# Altium schematic sheet IQ_modulator.SchDoc
size A4
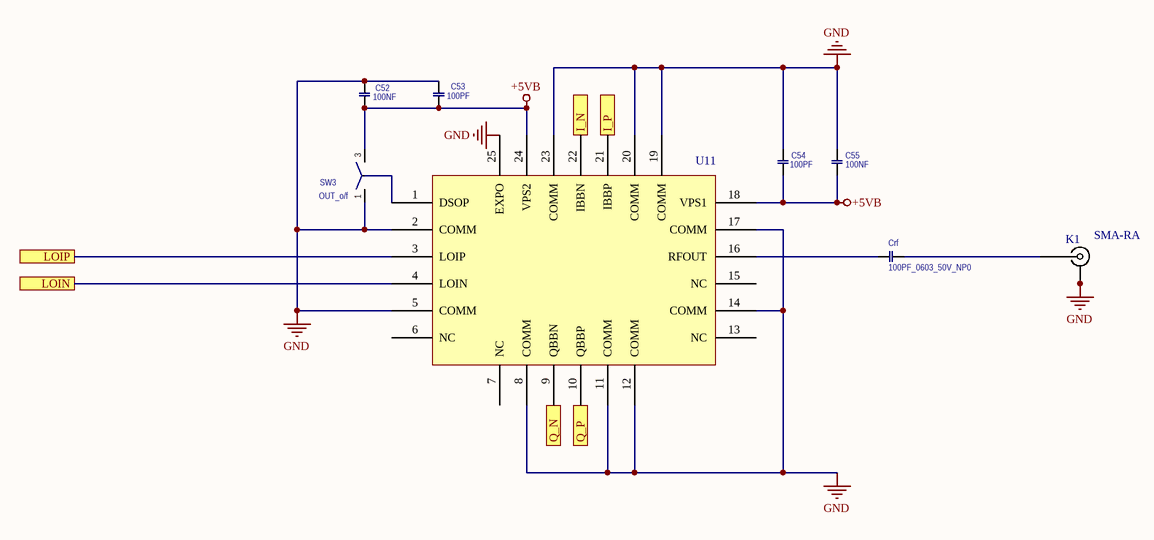
[diagram p0: IQ_modulator.SchDoc]

## Parts
C52  100NF  [CAP0603]
C53  100PF  [CAP0603]
C54  100PF  [CAP0603]
C55  100NF  [CAP0603]
Crf  100PF_0603_50V_NP0  [CAP0603]
K1  SMA-RA  [SMA-RA]
SW3  OUT_o/f  [X3APH-SLIDER]
U11  ADL5375  [LFCSP]  (value not drawn)

## Ports
I_N, I_P, LOIN, LOIP, Q_N, Q_P

## Nets
+5VB: C52.2 C53.2 C54.2 C55.2 SW3.3 U11.18(VPS1) U11.24(VPS2)
GND: C52.1 C53.1 C54.1 C55.1 K1.2 K1.3 K1.4 K1.5 SW3.1 U11.2(COMM) U11.5(COMM) U11.8(COMM) U11.11(COMM) U11.12(COMM) U11.14(COMM) U11.17(COMM) U11.19(COMM) U11.20(COMM) U11.23(COMM) U11.25(EXPO)
I_N: U11.22(IBBN) ; port I_N
I_P: U11.21(IBBP) ; port I_P
LOIN: U11.4(LOIN) ; port LOIN
LOIP: U11.3(LOIP) ; port LOIP
Q_N: U11.9(QBBN) ; port Q_N
Q_P: U11.10(QBBP) ; port Q_P
NetCrf_1: Crf.1 U11.16(RFOUT)
NetCrf_2: Crf.2 K1.1
NetSW3_2: SW3.2 U11.1(DSOP)

Not connected (* = marked no-connect by the designer): U11 6(NC) 7(NC) 13(NC) 15(NC)

## Library data of the parts
C52 C55 = 100NF_0603_50V_X7R: 128-8255    Capacitor MLC-X7R_0603_100NF_10%_50V; C0603C104K5RAC; KEMET; RoHS=Yes
C53 C54 Crf = 100PF_0603_50V_NP0: 141-4603    Capacitor MLC-NPO_0603_100PF_5%_50V; C0603C101J5GAC; KEMET; RoHS=Yes
K1 = SMA-RA: SMA THREADED RF CONNECTOR VERTICAL
SW3 = SLIDER3_TH_1: 674-345     SWITCH SLIDE SPDT VERT; 09-03290-01; EAO; RoHS=Yes